# Vivado block design system, xc7z020clg484-1, Vivado 2024.2
# (continued, part 2 of 2)
current_bd_instance /trx_1/rx_0

# ---- hierarchy /trx_1/tx_0 ----
current_bd_instance /trx_1/tx_0
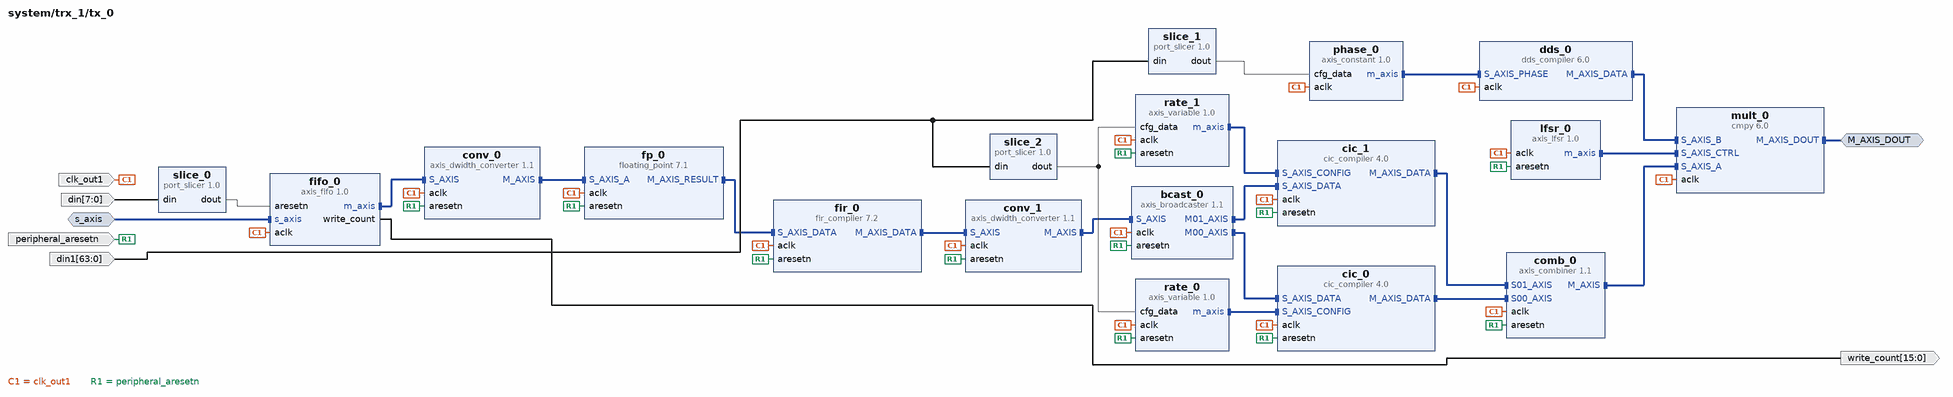
[diagram p6: block diagram inside /trx_1/tx_0]
create_bd_intf_pin -mode Slave -vlnv xilinx.com:interface:axis_rtl:1.0 s_axis
create_bd_intf_pin -mode Master -vlnv xilinx.com:interface:axis_rtl:1.0 M_AXIS_DOUT
create_bd_pin -dir I -type clk clk_out1
create_bd_pin -dir I -type rst peripheral_aresetn
create_bd_pin -dir I -from 7 -to 0 din
create_bd_pin -dir I -from 63 -to 0 din1
create_bd_pin -dir O -from 15 -to 0 write_count

create_bd_cell -type ip -vlnv pavel-demin:user:port_slicer:1.0 slice_0
set_property -dict {CONFIG.DIN_FROM 0 CONFIG.DIN_TO 0 CONFIG.DIN_WIDTH 8} [get_bd_cells slice_0]
create_bd_cell -type ip -vlnv pavel-demin:user:port_slicer:1.0 slice_1
set_property -dict {CONFIG.DIN_FROM 39 CONFIG.DIN_TO 0 CONFIG.DIN_WIDTH 64} [get_bd_cells slice_1]
create_bd_cell -type ip -vlnv pavel-demin:user:port_slicer:1.0 slice_2
set_property -dict {CONFIG.DIN_FROM 63 CONFIG.DIN_TO 48 CONFIG.DIN_WIDTH 64} [get_bd_cells slice_2]
create_bd_cell -type ip -vlnv pavel-demin:user:axis_fifo:1.0 fifo_0
set_property -dict [list \
  CONFIG.ALWAYS_VALID TRUE \
  CONFIG.M_AXIS_TDATA_WIDTH 64 \
  CONFIG.S_AXIS_TDATA_WIDTH 32 \
  CONFIG.WRITE_DEPTH 8192 \
] [get_bd_cells fifo_0]
create_bd_cell -type ip -vlnv xilinx.com:ip:axis_dwidth_converter:1.1 conv_0
set_property -dict {CONFIG.M_TDATA_NUM_BYTES 4 CONFIG.S_TDATA_NUM_BYTES 8} [get_bd_cells conv_0]
create_bd_cell -type ip -vlnv xilinx.com:ip:floating_point:7.1 fp_0
set_property -dict [list \
  CONFIG.C_Result_Exponent_Width 2 \
  CONFIG.C_Result_Fraction_Width 22 \
  CONFIG.Has_ARESETn true \
  CONFIG.Operation_Type Float_to_fixed \
  CONFIG.Result_Precision_Type Custom \
] [get_bd_cells fp_0]
create_bd_cell -type ip -vlnv xilinx.com:ip:fir_compiler:7.2 fir_0
set_property -dict [list \
  CONFIG.BestPrecision true \
  CONFIG.Clock_Frequency 122.88 \
  CONFIG.CoefficientVector {['-1.6474608535e-08, -4.7302195930e-08, -7.8619468076e-10, 3.0921189871e-08, 1.8608837232e-08, 3.2734022251e-08, -6.2813438189e-09, -1.5221363991e-07, -8.3032953559e-08, 3.1439829734e-07,', '3.0552900504e-07, -4.7396324870e-07, -7.1323740619e-07, 5.4707476786e-07, 1.3341171590e-06, -4.1393271599e-07, -2.1496782582e-06, -6.7769353338e-08, 3.0742601185e-06, 1.0366765715e-06,', '-3.9428070248e-06, -2.5909585490e-06, 4.5135845246e-06, 4.7460225319e-06, -4.4910558070e-06, -7.3953978786e-06, 3.5707408445e-06, 1.0285546038e-05, -1.5032224453e-06, -1.3015815434e-05,', '-1.8313444384e-06, 1.5072320650e-05, 6.3521132941e-06, -1.5899576427e-05, -1.1727813184e-05, 1.5005323291e-05, 1.7365093303e-05, -1.2089910213e-05, -2.2458022005e-05, 7.1673633916e-06,', '2.6093058018e-05, -6.6389116544e-07, -2.7418691729e-05, -6.5473442360e-06, 2.5854600003e-05, 1.3198330110e-05, -2.1309361735e-05, -1.7782206252e-05, 1.4361810624e-05, 1.8811515648e-05,', '-6.3566406461e-06, -1.5155979368e-05, -6.3247080943e-07, 6.4130448230e-06, 4.0040582068e-06, 6.7546397959e-06, -1.0026074055e-06, -2.2393312940e-05, -1.0760842920e-05, 3.7217184434e-05,', '3.2690283793e-05, -4.6839875203e-05, -6.4629245773e-05, 4.6239001154e-05, 1.0436232686e-04, -3.0525157948e-05, -1.4740012610e-04, -4.1219698477e-06, 1.8711256488e-04, 5.9452347683e-05,', '-2.1528991520e-04, -1.3425249804e-04, 2.2313567651e-04, 2.2375017156e-04, -2.0262013024e-04, -3.1950057315e-04, 1.4803738125e-04, 4.0989148374e-04, -5.7537086900e-05, -4.8132818219e-04,', '-6.5649818729e-05, 5.2004965910e-04, 2.1257912313e-04, -5.1442095551e-04, -3.6885882761e-04, 4.5729416912e-04, 5.1576895071e-04, -3.4835026230e-04, -6.3263165645e-04, 1.9558527632e-04,', '6.9991497630e-04, -1.5808526144e-05, -7.0293422773e-04, -1.6629328762e-04, 6.3560456533e-04, 3.2068673279e-04, -5.0363032844e-04, -4.1607263761e-04, 3.2646656336e-04, 4.2520826054e-04,', '-1.3744582074e-04, -3.3090412765e-04, -1.8384678041e-05, 1.3189799213e-04, 8.8910161182e-05, 1.5233898500e-04, -2.1947620222e-05, -4.7890099404e-04, -2.2611987722e-04, 7.8125561143e-04,', '6.8011510442e-04, -9.7341268920e-04, -1.3369440637e-03, 9.5707198274e-04, 2.1574180007e-03, -6.3274475096e-04, -3.0612079709e-03, -8.6312096489e-05, 3.9259517547e-03, 1.2584739205e-03,', '-4.5913883984e-03, -2.8979884036e-03, 4.8688805659e-03, 4.9608225128e-03, -4.5560763256e-03, -7.3338396684e-03, 3.4557999231e-03, 9.8287225977e-03, -1.3976559014e-03, -1.2181437284e-02,', '-1.7396234513e-03, 1.4056850557e-02, 6.0061144608e-03, -1.5059808596e-02, -1.1365595088e-02, 1.4742813384e-02, 1.7680205017e-02, -1.2613964567e-02, -2.4703438754e-02, 8.1283099644e-03,', '3.2073997143e-02, -6.4577008839e-04, -3.9302054798e-02, -1.0686996220e-02, 4.5719765638e-02, 2.7237877738e-02, -5.0304069016e-02, -5.1693673194e-02, 5.1004633533e-02, 9.0534093654e-02,', '-4.1604028747e-02, -1.6368908068e-01, -1.0763878172e-02, 3.5633171189e-01, 5.5470627800e-01, 3.5633171189e-01, -1.0763878172e-02, -1.6368908068e-01, -4.1604028747e-02, 9.0534093654e-02,', '5.1004633533e-02, -5.1693673194e-02, -5.0304069016e-02, 2.7237877738e-02, 4.5719765638e-02, -1.0686996220e-02, -3.9302054798e-02, -6.4577008839e-04, 3.2073997143e-02, 8.1283099644e-03,', '-2.4703438754e-02, -1.2613964567e-02, 1.7680205017e-02, 1.4742813384e-02, -1.1365595088e-02, -1.5059808596e-02, 6.0061144608e-03, 1.4056850557e-02, -1.7396234513e-03, -1.2181437284e-02,', '-1.3976559014e-03, 9.8287225977e-03, 3.4557999231e-03, -7.3338396684e-03, -4.5560763256e-03, 4.9608225128e-03, 4.8688805659e-03, -2.8979884036e-03, -4.5913883984e-03, 1.2584739205e-03,', '3.9259517547e-03, -8.6312096489e-05, -3.0612079709e-03, -6.3274475096e-04, 2.1574180007e-03, 9.5707198274e-04, -1.3369440637e-03, -9.7341268920e-04, 6.8011510442e-04, 7.8125561143e-04,', '-2.2611987722e-04, -4.7890099404e-04, -2.1947620222e-05, 1.5233898500e-04, 8.8910161182e-05, 1.3189799213e-04, -1.8384678041e-05, -3.3090412765e-04, -1.3744582074e-04, 4.2520826054e-04,', '3.2646656336e-04, -4.1607263761e-04, -5.0363032844e-04, 3.2068673279e-04, 6.3560456533e-04, -1.6629328762e-04, -7.0293422773e-04, -1.5808526144e-05, 6.9991497630e-04, 1.9558527632e-04,', '-6.3263165645e-04, -3.4835026230e-04, 5.1576895071e-04, 4.5729416912e-04, -3.6885882761e-04, -5.1442095551e-04, 2.1257912313e-04, 5.2004965910e-04, -6.5649818729e-05, -4.8132818219e-04,', '-5.7537086900e-05, 4.0989148374e-04, 1.4803738125e-04, -3.1950057315e-04, -2.0262013024e-04, 2.2375017156e-04, 2.2313567651e-04, -1.3425249804e-04, -2.1528991520e-04, 5.9452347683e-05,', '1.8711256488e-04, -4.1219698477e-06, -1.4740012610e-04, -3.0525157948e-05, 1.0436232686e-04, 4.6239001154e-05, -6.4629245773e-05, -4.6839875203e-05, 3.2690283793e-05, 3.7217184434e-05,', '-1.0760842920e-05, -2.2393312940e-05, -1.0026074055e-06, 6.7546397959e-06, 4.0040582068e-06, 6.4130448230e-06, -6.3247080943e-07, -1.5155979368e-05, -6.3566406461e-06, 1.8811515648e-05,', '1.4361810624e-05, -1.7782206252e-05, -2.1309361735e-05, 1.3198330110e-05, 2.5854600003e-05, -6.5473442360e-06, -2.7418691729e-05, -6.6389116544e-07, 2.6093058018e-05, 7.1673633916e-06,', '-2.2458022005e-05, -1.2089910213e-05, 1.7365093303e-05, 1.5005323291e-05, -1.1727813184e-05, -1.5899576427e-05, 6.3521132941e-06, 1.5072320650e-05, -1.8313444384e-06, -1.3015815434e-05,', '-1.5032224453e-06, 1.0285546038e-05, 3.5707408445e-06, -7.3953978786e-06, -4.4910558070e-06, 4.7460225319e-06, 4.5135845246e-06, -2.5909585490e-06, -3.9428070248e-06, 1.0366765715e-06,', '3.0742601185e-06, -6.7769353338e-08, -2.1496782582e-06, -4.1393271599e-07, 1.3341171590e-06, 5.4707476786e-07, -7.1323740619e-07, -4.7396324870e-07, 3.0552900504e-07, 3.1439829734e-07,', '-8.3032953559e-08, -1.5221363991e-07, -6.2813438189e-09, 3.2734022251e-08, 1.8608837232e-08, 3.0921189871e-08, -7.8619468076e-10, -4.7302195930e-08, -1.6474608535e-08']} \
  CONFIG.Coefficient_Width 24 \
  CONFIG.Data_Width 24 \
  CONFIG.Filter_Type Interpolation \
  CONFIG.Has_ARESETn true \
  CONFIG.Interpolation_Rate 2 \
  CONFIG.M_DATA_Has_TREADY true \
  CONFIG.Number_Channels 2 \
  CONFIG.Number_Paths 1 \
  CONFIG.Output_Rounding_Mode Convergent_Rounding_to_Even \
  CONFIG.Output_Width 25 \
  CONFIG.Quantization Quantize_Only \
  CONFIG.Sample_Frequency 1.536 \
] [get_bd_cells fir_0]
create_bd_cell -type ip -vlnv xilinx.com:ip:axis_dwidth_converter:1.1 conv_1
set_property -dict {CONFIG.M_TDATA_NUM_BYTES 8 CONFIG.S_TDATA_NUM_BYTES 4} [get_bd_cells conv_1]
create_bd_cell -type ip -vlnv xilinx.com:ip:axis_broadcaster:1.1 bcast_0
set_property -dict [list \
  CONFIG.HAS_TKEEP 0 \
  CONFIG.HAS_TLAST 0 \
  CONFIG.HAS_TREADY 1 \
  CONFIG.HAS_TSTRB 0 \
  CONFIG.M00_TDATA_REMAP {tdata[23:0]} \
  CONFIG.M01_TDATA_REMAP {tdata[55:32]} \
  CONFIG.M_TDATA_NUM_BYTES 3 \
  CONFIG.M_TUSER_WIDTH 0 \
  CONFIG.S_TDATA_NUM_BYTES 8 \
  CONFIG.S_TUSER_WIDTH 0 \
  CONFIG.TDEST_WIDTH 0 \
  CONFIG.TID_WIDTH 0 \
] [get_bd_cells bcast_0]
create_bd_cell -type ip -vlnv pavel-demin:user:axis_variable:1.0 rate_0
set_property -dict {CONFIG.AXIS_TDATA_WIDTH 16} [get_bd_cells rate_0]
create_bd_cell -type ip -vlnv pavel-demin:user:axis_variable:1.0 rate_1
set_property -dict {CONFIG.AXIS_TDATA_WIDTH 16} [get_bd_cells rate_1]
create_bd_cell -type ip -vlnv xilinx.com:ip:cic_compiler:4.0 cic_0
set_property -dict [list \
  CONFIG.Clock_Frequency 122.88 \
  CONFIG.Filter_Type Interpolation \
  CONFIG.Fixed_Or_Initial_Rate 640 \
  CONFIG.HAS_ARESETN true \
  CONFIG.Input_Data_Width 24 \
  CONFIG.Input_Sample_Frequency 3.072 \
  CONFIG.Maximum_Rate 8192 \
  CONFIG.Minimum_Rate 40 \
  CONFIG.Number_Of_Stages 6 \
  CONFIG.Output_Data_Width 24 \
  CONFIG.Quantization Truncation \
  CONFIG.Sample_Rate_Changes Programmable \
  CONFIG.Use_Xtreme_DSP_Slice false \
] [get_bd_cells cic_0]
create_bd_cell -type ip -vlnv xilinx.com:ip:cic_compiler:4.0 cic_1
set_property -dict [list \
  CONFIG.Clock_Frequency 122.88 \
  CONFIG.Filter_Type Interpolation \
  CONFIG.Fixed_Or_Initial_Rate 640 \
  CONFIG.HAS_ARESETN true \
  CONFIG.Input_Data_Width 24 \
  CONFIG.Input_Sample_Frequency 3.072 \
  CONFIG.Maximum_Rate 8192 \
  CONFIG.Minimum_Rate 40 \
  CONFIG.Number_Of_Stages 6 \
  CONFIG.Output_Data_Width 24 \
  CONFIG.Quantization Truncation \
  CONFIG.Sample_Rate_Changes Programmable \
  CONFIG.Use_Xtreme_DSP_Slice false \
] [get_bd_cells cic_1]
create_bd_cell -type ip -vlnv xilinx.com:ip:axis_combiner:1.1 comb_0
set_property -dict {CONFIG.TDATA_NUM_BYTES 3} [get_bd_cells comb_0]
create_bd_cell -type ip -vlnv pavel-demin:user:axis_constant:1.0 phase_0
set_property -dict {CONFIG.AXIS_TDATA_WIDTH 40} [get_bd_cells phase_0]
create_bd_cell -type ip -vlnv xilinx.com:ip:dds_compiler:6.0 dds_0
set_property -dict [list \
  CONFIG.DDS_Clock_Rate 122.88 \
  CONFIG.DSP48_Use Minimal \
  CONFIG.Frequency_Resolution 0.2 \
  CONFIG.Has_Phase_Out false \
  CONFIG.Output_Width 24 \
  CONFIG.Phase_Increment Streaming \
  CONFIG.Phase_Width 30 \
  CONFIG.Resync true \
  CONFIG.Spurious_Free_Dynamic_Range 138 \
] [get_bd_cells dds_0]
create_bd_cell -type ip -vlnv pavel-demin:user:axis_lfsr:1.0 lfsr_0
create_bd_cell -type ip -vlnv xilinx.com:ip:cmpy:6.0 mult_0
set_property -dict [list \
  CONFIG.APortWidth 24 \
  CONFIG.BPortWidth 24 \
  CONFIG.OutputWidth 17 \
  CONFIG.RoundMode Random_Rounding \
] [get_bd_cells mult_0]

# ---- connections ----

current_bd_instance /trx_0
connect_bd_intf_net [get_bd_intf_pins hub_0/s_axi] [get_bd_intf_pins s_axi]
connect_bd_intf_net [get_bd_intf_pins rx_0/S_AXIS_A] [get_bd_intf_pins S_AXIS_A]
connect_bd_intf_net [get_bd_intf_pins tx_0/M_AXIS_DOUT] [get_bd_intf_pins M_AXIS_DOUT]
connect_bd_intf_net [get_bd_intf_pins hub_0/m01_axis] [get_bd_intf_pins m01_axis]
connect_bd_intf_net [get_bd_intf_pins hub_0/m02_axis] [get_bd_intf_pins m02_axis]
connect_bd_intf_net [get_bd_intf_pins hub_0/m00_axis] [get_bd_intf_pins tx_0/s_axis]
connect_bd_intf_net [get_bd_intf_pins hub_0/s00_axis] [get_bd_intf_pins rx_0/m_axis]
connect_bd_net [get_bd_pins aclk] [get_bd_pins hub_0/aclk] [get_bd_pins rx_0/clk_out1] [get_bd_pins tx_0/clk_out1]
connect_bd_net [get_bd_pins aresetn] [get_bd_pins hub_0/aresetn] [get_bd_pins rx_0/peripheral_aresetn] [get_bd_pins tx_0/peripheral_aresetn]
connect_bd_net [get_bd_pins cfg_slice_0/dout] [get_bd_pins rx_0/din1]
connect_bd_net [get_bd_pins cfg_slice_1/dout] [get_bd_pins tx_0/din1]
connect_bd_net [get_bd_pins concat_0/dout] [get_bd_pins hub_0/sts_data]
connect_bd_net [get_bd_pins hub_0/cfg_data] \
  [get_bd_pins rst_slice_0/din] [get_bd_pins rst_slice_1/din] [get_bd_pins cfg_slice_0/din] [get_bd_pins cfg_slice_1/din]
connect_bd_net [get_bd_pins rst_slice_0/dout] [get_bd_pins rx_0/din]
connect_bd_net [get_bd_pins rst_slice_1/dout] [get_bd_pins tx_0/din]
connect_bd_net [get_bd_pins rx_0/read_count] [get_bd_pins concat_0/In0]
connect_bd_net [get_bd_pins tx_0/write_count] [get_bd_pins concat_0/In1]

current_bd_instance /trx_0/rx_0
connect_bd_intf_net [get_bd_intf_pins fifo_0/m_axis] [get_bd_intf_pins m_axis]
connect_bd_intf_net [get_bd_intf_pins mult_0/S_AXIS_A] [get_bd_intf_pins S_AXIS_A]
connect_bd_intf_net [get_bd_intf_pins cic_0/S_AXIS_DATA] [get_bd_intf_pins bcast_0/M00_AXIS]
connect_bd_intf_net [get_bd_intf_pins cic_1/S_AXIS_DATA] [get_bd_intf_pins bcast_0/M01_AXIS]
connect_bd_intf_net [get_bd_intf_pins comb_0/S00_AXIS] [get_bd_intf_pins cic_0/M_AXIS_DATA]
connect_bd_intf_net [get_bd_intf_pins comb_0/S01_AXIS] [get_bd_intf_pins cic_1/M_AXIS_DATA]
connect_bd_intf_net [get_bd_intf_pins conv_0/S_AXIS] [get_bd_intf_pins comb_0/M_AXIS]
connect_bd_intf_net [get_bd_intf_pins fir_0/S_AXIS_DATA] [get_bd_intf_pins conv_0/M_AXIS]
connect_bd_intf_net [get_bd_intf_pins fifo_0/s_axis] [get_bd_intf_pins conv_1/M_AXIS]
connect_bd_intf_net [get_bd_intf_pins mult_0/S_AXIS_B] [get_bd_intf_pins dds_0/M_AXIS_DATA]
connect_bd_intf_net [get_bd_intf_pins subset_0/S_AXIS] [get_bd_intf_pins fir_0/M_AXIS_DATA]
connect_bd_intf_net [get_bd_intf_pins conv_1/S_AXIS] [get_bd_intf_pins fp_0/M_AXIS_RESULT]
connect_bd_intf_net [get_bd_intf_pins mult_0/S_AXIS_CTRL] [get_bd_intf_pins lfsr_0/m_axis]
connect_bd_intf_net [get_bd_intf_pins bcast_0/S_AXIS] [get_bd_intf_pins mult_0/M_AXIS_DOUT]
connect_bd_intf_net [get_bd_intf_pins dds_0/S_AXIS_PHASE] [get_bd_intf_pins phase_0/m_axis]
connect_bd_intf_net [get_bd_intf_pins cic_0/S_AXIS_CONFIG] [get_bd_intf_pins rate_0/m_axis]
connect_bd_intf_net [get_bd_intf_pins cic_1/S_AXIS_CONFIG] [get_bd_intf_pins rate_1/m_axis]
connect_bd_intf_net [get_bd_intf_pins fp_0/S_AXIS_A] [get_bd_intf_pins subset_0/M_AXIS]
connect_bd_net -net clk_out1_1 [get_bd_pins clk_out1] \
  [get_bd_pins phase_0/aclk] [get_bd_pins dds_0/aclk] [get_bd_pins lfsr_0/aclk] [get_bd_pins mult_0/aclk] \
  [get_bd_pins bcast_0/aclk] [get_bd_pins rate_0/aclk] [get_bd_pins rate_1/aclk] [get_bd_pins cic_0/aclk] \
  [get_bd_pins cic_1/aclk] [get_bd_pins comb_0/aclk] [get_bd_pins conv_0/aclk] [get_bd_pins fir_0/aclk] \
  [get_bd_pins subset_0/aclk] [get_bd_pins fp_0/aclk] [get_bd_pins conv_1/aclk] [get_bd_pins fifo_0/aclk]
connect_bd_net -net din1_1 [get_bd_pins din1] [get_bd_pins slice_1/din] [get_bd_pins slice_2/din]
connect_bd_net [get_bd_pins din] [get_bd_pins slice_0/din]
connect_bd_net [get_bd_pins fifo_0/read_count] [get_bd_pins read_count]
connect_bd_net [get_bd_pins peripheral_aresetn] \
  [get_bd_pins lfsr_0/aresetn] [get_bd_pins bcast_0/aresetn] [get_bd_pins rate_0/aresetn] [get_bd_pins rate_1/aresetn] \
  [get_bd_pins cic_0/aresetn] [get_bd_pins cic_1/aresetn] [get_bd_pins comb_0/aresetn] [get_bd_pins conv_0/aresetn] \
  [get_bd_pins fir_0/aresetn] [get_bd_pins subset_0/aresetn] [get_bd_pins fp_0/aresetn] [get_bd_pins conv_1/aresetn]
connect_bd_net [get_bd_pins slice_0/dout] [get_bd_pins fifo_0/aresetn]
connect_bd_net [get_bd_pins slice_1/dout] [get_bd_pins phase_0/cfg_data]
connect_bd_net [get_bd_pins slice_2/dout] [get_bd_pins rate_0/cfg_data] [get_bd_pins rate_1/cfg_data]

current_bd_instance /trx_0/tx_0
connect_bd_intf_net [get_bd_intf_pins fifo_0/s_axis] [get_bd_intf_pins s_axis]
connect_bd_intf_net [get_bd_intf_pins mult_0/M_AXIS_DOUT] [get_bd_intf_pins M_AXIS_DOUT]
connect_bd_intf_net [get_bd_intf_pins cic_0/S_AXIS_DATA] [get_bd_intf_pins bcast_0/M00_AXIS]
connect_bd_intf_net [get_bd_intf_pins cic_1/S_AXIS_DATA] [get_bd_intf_pins bcast_0/M01_AXIS]
connect_bd_intf_net [get_bd_intf_pins comb_0/S00_AXIS] [get_bd_intf_pins cic_0/M_AXIS_DATA]
connect_bd_intf_net [get_bd_intf_pins comb_0/S01_AXIS] [get_bd_intf_pins cic_1/M_AXIS_DATA]
connect_bd_intf_net [get_bd_intf_pins mult_0/S_AXIS_A] [get_bd_intf_pins comb_0/M_AXIS]
connect_bd_intf_net [get_bd_intf_pins fp_0/S_AXIS_A] [get_bd_intf_pins conv_0/M_AXIS]
connect_bd_intf_net [get_bd_intf_pins bcast_0/S_AXIS] [get_bd_intf_pins conv_1/M_AXIS]
connect_bd_intf_net [get_bd_intf_pins mult_0/S_AXIS_B] [get_bd_intf_pins dds_0/M_AXIS_DATA]
connect_bd_intf_net [get_bd_intf_pins conv_0/S_AXIS] [get_bd_intf_pins fifo_0/m_axis]
connect_bd_intf_net [get_bd_intf_pins conv_1/S_AXIS] [get_bd_intf_pins fir_0/M_AXIS_DATA]
connect_bd_intf_net [get_bd_intf_pins fir_0/S_AXIS_DATA] [get_bd_intf_pins fp_0/M_AXIS_RESULT]
connect_bd_intf_net [get_bd_intf_pins mult_0/S_AXIS_CTRL] [get_bd_intf_pins lfsr_0/m_axis]
connect_bd_intf_net [get_bd_intf_pins dds_0/S_AXIS_PHASE] [get_bd_intf_pins phase_0/m_axis]
connect_bd_intf_net [get_bd_intf_pins cic_0/S_AXIS_CONFIG] [get_bd_intf_pins rate_0/m_axis]
connect_bd_intf_net [get_bd_intf_pins cic_1/S_AXIS_CONFIG] [get_bd_intf_pins rate_1/m_axis]
connect_bd_net -net clk_out1_1 [get_bd_pins clk_out1] \
  [get_bd_pins fifo_0/aclk] [get_bd_pins conv_0/aclk] [get_bd_pins fp_0/aclk] [get_bd_pins fir_0/aclk] \
  [get_bd_pins conv_1/aclk] [get_bd_pins bcast_0/aclk] [get_bd_pins rate_0/aclk] [get_bd_pins rate_1/aclk] \
  [get_bd_pins cic_0/aclk] [get_bd_pins cic_1/aclk] [get_bd_pins comb_0/aclk] [get_bd_pins phase_0/aclk] \
  [get_bd_pins dds_0/aclk] [get_bd_pins lfsr_0/aclk] [get_bd_pins mult_0/aclk]
connect_bd_net -net din1_1 [get_bd_pins din1] [get_bd_pins slice_1/din] [get_bd_pins slice_2/din]
connect_bd_net [get_bd_pins din] [get_bd_pins slice_0/din]
connect_bd_net [get_bd_pins fifo_0/write_count] [get_bd_pins write_count]
connect_bd_net [get_bd_pins peripheral_aresetn] \
  [get_bd_pins conv_0/aresetn] [get_bd_pins fp_0/aresetn] [get_bd_pins fir_0/aresetn] [get_bd_pins conv_1/aresetn] \
  [get_bd_pins bcast_0/aresetn] [get_bd_pins rate_0/aresetn] [get_bd_pins rate_1/aresetn] [get_bd_pins cic_0/aresetn] \
  [get_bd_pins cic_1/aresetn] [get_bd_pins comb_0/aresetn] [get_bd_pins lfsr_0/aresetn]
connect_bd_net [get_bd_pins slice_0/dout] [get_bd_pins fifo_0/aresetn]
connect_bd_net [get_bd_pins slice_1/dout] [get_bd_pins phase_0/cfg_data]
connect_bd_net [get_bd_pins slice_2/dout] [get_bd_pins rate_0/cfg_data] [get_bd_pins rate_1/cfg_data]

current_bd_instance /trx_1
connect_bd_intf_net [get_bd_intf_pins hub_0/s_axi] [get_bd_intf_pins s_axi]
connect_bd_intf_net [get_bd_intf_pins rx_0/S_AXIS_A] [get_bd_intf_pins S_AXIS_A]
connect_bd_intf_net [get_bd_intf_pins tx_0/M_AXIS_DOUT] [get_bd_intf_pins M_AXIS_DOUT]
connect_bd_intf_net [get_bd_intf_pins hub_0/m00_axis] [get_bd_intf_pins tx_0/s_axis]
connect_bd_intf_net [get_bd_intf_pins hub_0/s00_axis] [get_bd_intf_pins rx_0/m_axis]
connect_bd_net [get_bd_pins aclk] [get_bd_pins hub_0/aclk] [get_bd_pins rx_0/clk_out1] [get_bd_pins tx_0/clk_out1]
connect_bd_net [get_bd_pins aresetn] [get_bd_pins hub_0/aresetn] [get_bd_pins rx_0/peripheral_aresetn] [get_bd_pins tx_0/peripheral_aresetn]
connect_bd_net [get_bd_pins cfg_slice_0/dout] [get_bd_pins rx_0/din1]
connect_bd_net [get_bd_pins cfg_slice_1/dout] [get_bd_pins tx_0/din1]
connect_bd_net [get_bd_pins concat_0/dout] [get_bd_pins hub_0/sts_data]
connect_bd_net [get_bd_pins hub_0/cfg_data] \
  [get_bd_pins rst_slice_0/din] [get_bd_pins rst_slice_1/din] [get_bd_pins cfg_slice_0/din] [get_bd_pins cfg_slice_1/din]
connect_bd_net [get_bd_pins rst_slice_0/dout] [get_bd_pins rx_0/din]
connect_bd_net [get_bd_pins rst_slice_1/dout] [get_bd_pins tx_0/din]
connect_bd_net [get_bd_pins rx_0/read_count] [get_bd_pins concat_0/In0]
connect_bd_net [get_bd_pins tx_0/write_count] [get_bd_pins concat_0/In1]

current_bd_instance /trx_1/rx_0
connect_bd_intf_net [get_bd_intf_pins fifo_0/m_axis] [get_bd_intf_pins m_axis]
connect_bd_intf_net [get_bd_intf_pins mult_0/S_AXIS_A] [get_bd_intf_pins S_AXIS_A]
connect_bd_intf_net [get_bd_intf_pins cic_0/S_AXIS_DATA] [get_bd_intf_pins bcast_0/M00_AXIS]
connect_bd_intf_net [get_bd_intf_pins cic_1/S_AXIS_DATA] [get_bd_intf_pins bcast_0/M01_AXIS]
connect_bd_intf_net [get_bd_intf_pins comb_0/S00_AXIS] [get_bd_intf_pins cic_0/M_AXIS_DATA]
connect_bd_intf_net [get_bd_intf_pins comb_0/S01_AXIS] [get_bd_intf_pins cic_1/M_AXIS_DATA]
connect_bd_intf_net [get_bd_intf_pins conv_0/S_AXIS] [get_bd_intf_pins comb_0/M_AXIS]
connect_bd_intf_net [get_bd_intf_pins fir_0/S_AXIS_DATA] [get_bd_intf_pins conv_0/M_AXIS]
connect_bd_intf_net [get_bd_intf_pins fifo_0/s_axis] [get_bd_intf_pins conv_1/M_AXIS]
connect_bd_intf_net [get_bd_intf_pins mult_0/S_AXIS_B] [get_bd_intf_pins dds_0/M_AXIS_DATA]
connect_bd_intf_net [get_bd_intf_pins subset_0/S_AXIS] [get_bd_intf_pins fir_0/M_AXIS_DATA]
connect_bd_intf_net [get_bd_intf_pins conv_1/S_AXIS] [get_bd_intf_pins fp_0/M_AXIS_RESULT]
connect_bd_intf_net [get_bd_intf_pins mult_0/S_AXIS_CTRL] [get_bd_intf_pins lfsr_0/m_axis]
connect_bd_intf_net [get_bd_intf_pins bcast_0/S_AXIS] [get_bd_intf_pins mult_0/M_AXIS_DOUT]
connect_bd_intf_net [get_bd_intf_pins dds_0/S_AXIS_PHASE] [get_bd_intf_pins phase_0/m_axis]
connect_bd_intf_net [get_bd_intf_pins cic_0/S_AXIS_CONFIG] [get_bd_intf_pins rate_0/m_axis]
connect_bd_intf_net [get_bd_intf_pins cic_1/S_AXIS_CONFIG] [get_bd_intf_pins rate_1/m_axis]
connect_bd_intf_net [get_bd_intf_pins fp_0/S_AXIS_A] [get_bd_intf_pins subset_0/M_AXIS]
connect_bd_net -net clk_out1_1 [get_bd_pins clk_out1] \
  [get_bd_pins phase_0/aclk] [get_bd_pins dds_0/aclk] [get_bd_pins lfsr_0/aclk] [get_bd_pins mult_0/aclk] \
  [get_bd_pins bcast_0/aclk] [get_bd_pins rate_0/aclk] [get_bd_pins rate_1/aclk] [get_bd_pins cic_0/aclk] \
  [get_bd_pins cic_1/aclk] [get_bd_pins comb_0/aclk] [get_bd_pins conv_0/aclk] [get_bd_pins fir_0/aclk] \
  [get_bd_pins subset_0/aclk] [get_bd_pins fp_0/aclk] [get_bd_pins conv_1/aclk] [get_bd_pins fifo_0/aclk]
connect_bd_net -net din1_1 [get_bd_pins din1] [get_bd_pins slice_1/din] [get_bd_pins slice_2/din]
connect_bd_net [get_bd_pins din] [get_bd_pins slice_0/din]
connect_bd_net [get_bd_pins fifo_0/read_count] [get_bd_pins read_count]
connect_bd_net [get_bd_pins peripheral_aresetn] \
  [get_bd_pins lfsr_0/aresetn] [get_bd_pins bcast_0/aresetn] [get_bd_pins rate_0/aresetn] [get_bd_pins rate_1/aresetn] \
  [get_bd_pins cic_0/aresetn] [get_bd_pins cic_1/aresetn] [get_bd_pins comb_0/aresetn] [get_bd_pins conv_0/aresetn] \
  [get_bd_pins fir_0/aresetn] [get_bd_pins subset_0/aresetn] [get_bd_pins fp_0/aresetn] [get_bd_pins conv_1/aresetn]
connect_bd_net [get_bd_pins slice_0/dout] [get_bd_pins fifo_0/aresetn]
connect_bd_net [get_bd_pins slice_1/dout] [get_bd_pins phase_0/cfg_data]
connect_bd_net [get_bd_pins slice_2/dout] [get_bd_pins rate_0/cfg_data] [get_bd_pins rate_1/cfg_data]

current_bd_instance /trx_1/tx_0
connect_bd_intf_net [get_bd_intf_pins fifo_0/s_axis] [get_bd_intf_pins s_axis]
connect_bd_intf_net [get_bd_intf_pins mult_0/M_AXIS_DOUT] [get_bd_intf_pins M_AXIS_DOUT]
connect_bd_intf_net [get_bd_intf_pins cic_0/S_AXIS_DATA] [get_bd_intf_pins bcast_0/M00_AXIS]
connect_bd_intf_net [get_bd_intf_pins cic_1/S_AXIS_DATA] [get_bd_intf_pins bcast_0/M01_AXIS]
connect_bd_intf_net [get_bd_intf_pins comb_0/S00_AXIS] [get_bd_intf_pins cic_0/M_AXIS_DATA]
connect_bd_intf_net [get_bd_intf_pins comb_0/S01_AXIS] [get_bd_intf_pins cic_1/M_AXIS_DATA]
connect_bd_intf_net [get_bd_intf_pins mult_0/S_AXIS_A] [get_bd_intf_pins comb_0/M_AXIS]
connect_bd_intf_net [get_bd_intf_pins fp_0/S_AXIS_A] [get_bd_intf_pins conv_0/M_AXIS]
connect_bd_intf_net [get_bd_intf_pins bcast_0/S_AXIS] [get_bd_intf_pins conv_1/M_AXIS]
connect_bd_intf_net [get_bd_intf_pins mult_0/S_AXIS_B] [get_bd_intf_pins dds_0/M_AXIS_DATA]
connect_bd_intf_net [get_bd_intf_pins conv_0/S_AXIS] [get_bd_intf_pins fifo_0/m_axis]
connect_bd_intf_net [get_bd_intf_pins conv_1/S_AXIS] [get_bd_intf_pins fir_0/M_AXIS_DATA]
connect_bd_intf_net [get_bd_intf_pins fir_0/S_AXIS_DATA] [get_bd_intf_pins fp_0/M_AXIS_RESULT]
connect_bd_intf_net [get_bd_intf_pins mult_0/S_AXIS_CTRL] [get_bd_intf_pins lfsr_0/m_axis]
connect_bd_intf_net [get_bd_intf_pins dds_0/S_AXIS_PHASE] [get_bd_intf_pins phase_0/m_axis]
connect_bd_intf_net [get_bd_intf_pins cic_0/S_AXIS_CONFIG] [get_bd_intf_pins rate_0/m_axis]
connect_bd_intf_net [get_bd_intf_pins cic_1/S_AXIS_CONFIG] [get_bd_intf_pins rate_1/m_axis]
connect_bd_net -net clk_out1_1 [get_bd_pins clk_out1] \
  [get_bd_pins fifo_0/aclk] [get_bd_pins conv_0/aclk] [get_bd_pins fp_0/aclk] [get_bd_pins fir_0/aclk] \
  [get_bd_pins conv_1/aclk] [get_bd_pins bcast_0/aclk] [get_bd_pins rate_0/aclk] [get_bd_pins rate_1/aclk] \
  [get_bd_pins cic_0/aclk] [get_bd_pins cic_1/aclk] [get_bd_pins comb_0/aclk] [get_bd_pins phase_0/aclk] \
  [get_bd_pins dds_0/aclk] [get_bd_pins lfsr_0/aclk] [get_bd_pins mult_0/aclk]
connect_bd_net -net din1_1 [get_bd_pins din1] [get_bd_pins slice_1/din] [get_bd_pins slice_2/din]
connect_bd_net [get_bd_pins din] [get_bd_pins slice_0/din]
connect_bd_net [get_bd_pins fifo_0/write_count] [get_bd_pins write_count]
connect_bd_net [get_bd_pins peripheral_aresetn] \
  [get_bd_pins conv_0/aresetn] [get_bd_pins fp_0/aresetn] [get_bd_pins fir_0/aresetn] [get_bd_pins conv_1/aresetn] \
  [get_bd_pins bcast_0/aresetn] [get_bd_pins rate_0/aresetn] [get_bd_pins rate_1/aresetn] [get_bd_pins cic_0/aresetn] \
  [get_bd_pins cic_1/aresetn] [get_bd_pins comb_0/aresetn] [get_bd_pins lfsr_0/aresetn]
connect_bd_net [get_bd_pins slice_0/dout] [get_bd_pins fifo_0/aresetn]
connect_bd_net [get_bd_pins slice_1/dout] [get_bd_pins phase_0/cfg_data]
connect_bd_net [get_bd_pins slice_2/dout] [get_bd_pins rate_0/cfg_data] [get_bd_pins rate_1/cfg_data]

current_bd_instance /
connect_bd_intf_net [get_bd_intf_pins bcast_0/S_AXIS] [get_bd_intf_pins adc_0/m_axis]
connect_bd_intf_net [get_bd_intf_pins bcast_0/M00_AXIS] [get_bd_intf_pins trx_0/S_AXIS_A]
connect_bd_intf_net [get_bd_intf_pins bcast_0/M01_AXIS] [get_bd_intf_pins trx_1/S_AXIS_A]
connect_bd_intf_net [get_bd_intf_pins dac_0/s_axis] [get_bd_intf_pins comb_0/M_AXIS]
connect_bd_intf_net [get_bd_intf_pins spi_0/s_axis] [get_bd_intf_pins fifo_0/m_axis]
connect_bd_intf_net [get_bd_intf_pins spi_1/s_axis] [get_bd_intf_pins fifo_1/m_axis]
connect_bd_intf_net [get_bd_intf_ports DDR] [get_bd_intf_pins ps_0/DDR]
connect_bd_intf_net [get_bd_intf_ports FIXED_IO] [get_bd_intf_pins ps_0/FIXED_IO]
connect_bd_intf_net [get_bd_intf_pins ps_0/M_AXI_GP0] [get_bd_intf_pins trx_0/s_axi]
connect_bd_intf_net [get_bd_intf_pins ps_0/M_AXI_GP1] [get_bd_intf_pins trx_1/s_axi]
connect_bd_intf_net [get_bd_intf_pins comb_0/S00_AXIS] [get_bd_intf_pins trx_0/M_AXIS_DOUT]
connect_bd_intf_net [get_bd_intf_pins fifo_0/s_axis] [get_bd_intf_pins trx_0/m01_axis]
connect_bd_intf_net [get_bd_intf_pins fifo_1/s_axis] [get_bd_intf_pins trx_0/m02_axis]
connect_bd_intf_net [get_bd_intf_pins comb_0/S01_AXIS] [get_bd_intf_pins trx_1/M_AXIS_DOUT]
connect_bd_net [get_bd_ports cdce_iic_tri_io] [get_bd_pins iic_0/iic]
connect_bd_net [get_bd_ports cdce_gpio_tri_io] [get_bd_pins gpio_0/gpio]
connect_bd_net [get_bd_ports dac_tri_io] [get_bd_pins gpio_1/gpio]
connect_bd_net [get_bd_ports adc_data_i] [get_bd_pins adc_0/adc_data]
connect_bd_net [get_bd_ports adc_dco_i] [get_bd_pins pll_0/clk_in1]
connect_bd_net [get_bd_pins const_0/dout] [get_bd_pins rst_0/ext_reset_in]
connect_bd_net [get_bd_pins dac_0/dac_clk] [get_bd_ports dac_clk_o]
connect_bd_net [get_bd_pins dac_0/dac_data] [get_bd_ports dac_data_o]
connect_bd_net [get_bd_pins pll_0/clk_out1] \
  [get_bd_pins ps_0/M_AXI_GP0_ACLK] [get_bd_pins ps_0/M_AXI_GP1_ACLK] [get_bd_pins rst_0/slowest_sync_clk] \
  [get_bd_pins adc_0/aclk] [get_bd_pins bcast_0/aclk] [get_bd_pins comb_0/aclk] [get_bd_pins dac_0/aclk] \
  [get_bd_pins trx_0/aclk] [get_bd_pins trx_1/aclk] [get_bd_pins fifo_0/aclk] [get_bd_pins spi_0/aclk] \
  [get_bd_pins fifo_1/aclk] [get_bd_pins spi_1/aclk]
connect_bd_net [get_bd_pins pll_0/locked] [get_bd_pins rst_0/dcm_locked] [get_bd_pins dac_0/locked]
connect_bd_net [get_bd_pins ps_0/FCLK_CLK0] [get_bd_pins iic_0/aclk] [get_bd_pins gpio_0/aclk] [get_bd_pins gpio_1/aclk]
connect_bd_net [get_bd_pins rst_0/peripheral_aresetn] \
  [get_bd_pins bcast_0/aresetn] [get_bd_pins comb_0/aresetn] [get_bd_pins trx_0/aresetn] [get_bd_pins trx_1/aresetn] \
  [get_bd_pins fifo_0/aresetn] [get_bd_pins spi_0/aresetn] [get_bd_pins fifo_1/aresetn] [get_bd_pins spi_1/aresetn]
connect_bd_net [get_bd_pins spi_0/spi_data] [get_bd_ports adc_spi_o]
connect_bd_net [get_bd_pins spi_1/spi_data] [get_bd_ports dac_spi_o]

validate_bd_design
save_bd_design
